# Altium schematic sheet CONNECTOR_B.SchDoc: =project_title
size Tabloid; CompanyName: Luxonis Holding; Organization: Luxonis Holding; Address1: 1925 Harmony Park Drive; Address2: Westminster, CO; Address3: 80234; Address4: United States; SheetNumber: 6; SheetTotal: 14
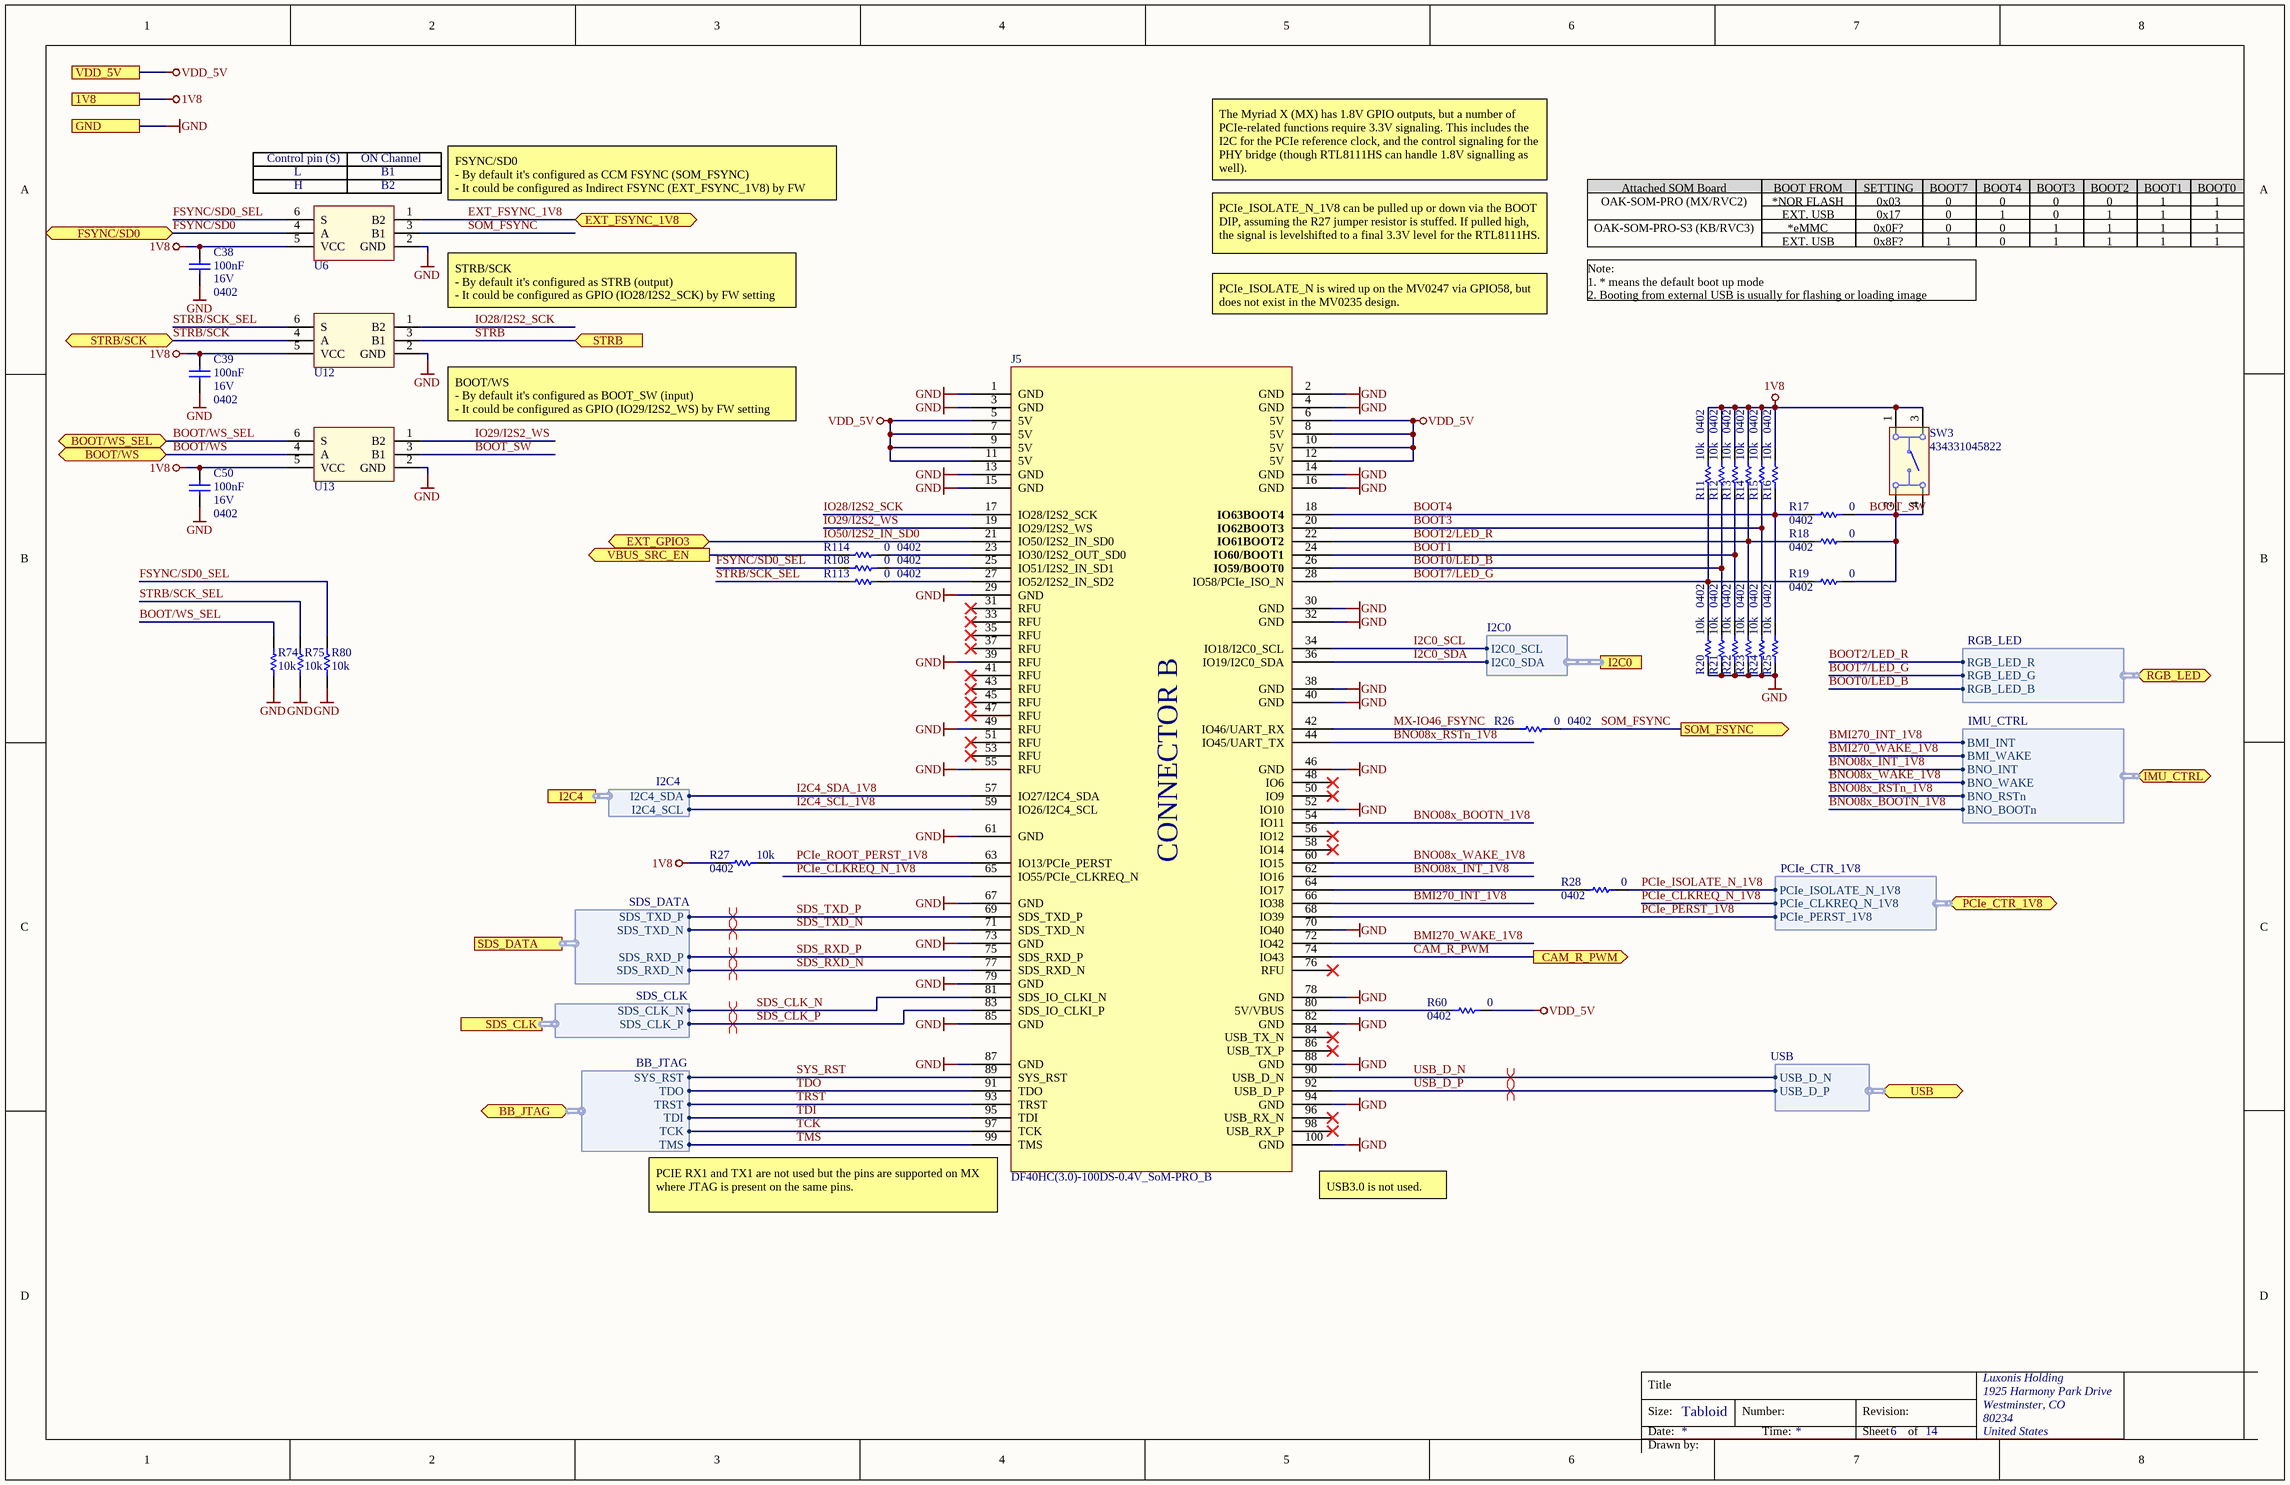
[diagram p0: CONNECTOR_B.SchDoc]

## Parts
C38  value 100nF  Voltage Rating: 16V  Case/Package: 0402  [CAPC0402(1005)60_N]  (hidden comment: CL05B104KO5NFNC)
C39  value 100nF  Voltage Rating: 16V  Case/Package: 0402  [CAPC0402(1005)60_N]  (hidden comment: CL05B104KO5NFNC)
C50  value 100nF  Voltage Rating: 16V  Case/Package: 0402  [CAPC0402(1005)60_N]  (hidden comment: CL05B104KO5NFNC)
J5  DF40HC(3.0)-100DS-0.4V_SoM-PRO_B  [CON_B_BW2099_SoM_DF40HC-3.0-100DS-0.4V_minpad]
R11  value 10k  Case/Package: 0402  [RESC0402(1005)_N]  (hidden comment: RC0402FR-1310KL)
R12  value 10k  Case/Package: 0402  [RESC0402(1005)_N]  (hidden comment: RC0402FR-1310KL)
R13  value 10k  Case/Package: 0402  [RESC0402(1005)_N]  (hidden comment: RC0402FR-1310KL)
R14  value 10k  Case/Package: 0402  [RESC0402(1005)_N]  (hidden comment: RC0402FR-1310KL)
R15  value 10k  Case/Package: 0402  [RESC0402(1005)_N]  (hidden comment: RC0402FR-1310KL)
R16  value 10k  Case/Package: 0402  [RESC0402(1005)_N]  (hidden comment: RC0402FR-1310KL)
R17  value 0  Case/Package: 0402  [RESC0402(1005)_L]  (hidden comment: CRCW04020000Z0ED)
R18  value 0  Case/Package: 0402  [RESC0402(1005)_L]  (hidden comment: CRCW04020000Z0ED)
R19  value 0  Case/Package: 0402  [RESC0402(1005)_L]  (hidden comment: CRCW04020000Z0ED)
R20  value 10k  Case/Package: 0402  [RESC0402(1005)_N]  (hidden comment: RC0402FR-1310KL)
R21  value 10k  Case/Package: 0402  [RESC0402(1005)_N]  (hidden comment: RC0402FR-1310KL)
R22  value 10k  Case/Package: 0402  [RESC0402(1005)_N]  (hidden comment: RC0402FR-1310KL)
R23  value 10k  Case/Package: 0402  [RESC0402(1005)_N]  (hidden comment: RC0402FR-1310KL)
R24  value 10k  Case/Package: 0402  [RESC0402(1005)_N]  (hidden comment: RC0402FR-1310KL)
R25  value 10k  Case/Package: 0402  [RESC0402(1005)_N]  (hidden comment: RC0402FR-1310KL)
R26  value 0  Case/Package: 0402  [RESC0402(1005)_L]  (hidden comment: CRCW04020000Z0ED)
R27  value 10k  Case/Package: 0402  [RESC0402(1005)_N]  (hidden comment: RC0402FR-1310KL)
R28  value 0  Case/Package: 0402  [RESC0402(1005)_L]  (hidden comment: CRCW04020000Z0ED)
R60  value 0  Case/Package: 0402  [RESC0402(1005)_L]  (hidden comment: CRCW04020000Z0ED)
R74  value 10k  [RESC0402(1005)_N]  (hidden comment: RC0402FR-1310KL)
R75  value 10k  [RESC0402(1005)_N]  (hidden comment: RC0402FR-1310KL)
R80  value 10k  [RESC0402(1005)_N]  (hidden comment: RC0402FR-1310KL)
R108  value 0  Case/Package: 0402  [RESC0402(1005)_L]  (hidden comment: CRCW04020000Z0ED)
R113  value 0  Case/Package: 0402  [RESC0402(1005)_L]  (hidden comment: CRCW04020000Z0ED)
R114  value 0  Case/Package: 0402  [RESC0402(1005)_L]  (hidden comment: CRCW04020000Z0ED)
SW3  434331045822  [434331045822]
U6  SN74LVC1G3157DCKR  [DCK6_65]  (value not drawn)
U12  SN74LVC1G3157DCKR  [DCK6_65]  (value not drawn)
U13  SN74LVC1G3157DCKR  [DCK6_65]  (value not drawn)

## Ports
1V8, BB_JTAG (bidir, harness BB_JTAG), BOOT/WS (bidir), BOOT/WS_SEL (bidir), CAM_R_PWM (out), EXT_FSYNC_1V8 (bidir), EXT_GPIO3 (bidir), FSYNC/SD0 (bidir), GND, I2C0 (harness I2C0), I2C4 (harness I2C4), IMU_CTRL (bidir, harness IMU_CTRL), PCIe_CTR_1V8 (bidir, harness PCIe_CTR_1V8), RGB_LED (bidir, harness RGB_LED), SDS_CLK (harness SDS_CLK), SDS_DATA (harness SDS_DATA), SOM_FSYNC (out), STRB (in), STRB/SCK (bidir), USB (bidir, harness USB), VBUS_SRC_EN (out), VDD_5V

## Harnesses
USB: USB_D_P, USB_D_N
I2C0: I2C0_SDA, I2C0_SCL
BB_JTAG: SYS_RST, TDO, TRST, TDI, TCK, TMS
SDS_DATA: SDS_TXD_P, SDS_TXD_N, SDS_RXD_P, SDS_RXD_N
PCIe_CTR_1V8: PCIe_CLKREQ_N_1V8, PCIe_ISOLATE_N_1V8, PCIe_PERST_1V8
SDS_CLK: SDS_CLK_P, SDS_CLK_N
RGB_LED: RGB_LED_G, RGB_LED_B, RGB_LED_R
IMU_CTRL: BMI_INT, BMI_WAKE, BNO_INT, BNO_WAKE, BNO_RSTn, BNO_BOOTn
I2C4: I2C4_SDA, I2C4_SCL

## Nets
1V8: C38.2 C39.2 C50.2 R11.2 R12.2 R13.2 R14.2 R15.2 R16.2 R27.2 SW3.1 SW3.3 U6.5(VCC) U12.5(VCC) U13.5(VCC) ; port 1V8
GND: C38.1 C39.1 C50.1 J5.1(GND) J5.2(GND) J5.3(GND) J5.4(GND) J5.13(GND) J5.14(GND) J5.15(GND) J5.16(GND) J5.29(GND) J5.30(GND) J5.32(GND) J5.38(GND) J5.39(RFU) J5.40(GND) J5.46(GND) J5.49(RFU) J5.52(IO10) J5.55(RFU) J5.61(GND) J5.67(GND) J5.70(IO40) J5.73(GND) J5.78(GND) J5.79(GND) J5.82(GND) J5.85(GND) J5.87(GND) J5.88(GND) J5.94(GND) J5.100(GND) R20.1 R21.1 R22.1 R23.1 R24.1 R25.1 R74.1 R75.1 R80.1 U6.2(GND) U12.2(GND) U13.2(GND) ; port GND
VDD_5V: J5.5(5V) J5.6(5V) J5.7(5V) J5.8(5V) J5.9(5V) J5.10(5V) J5.11(5V) J5.12(5V) R60.2 ; port VDD_5V
BMI270_INT_1V8: J5.66(IO38) ; port IMU_CTRL.BMI_INT
BMI270_WAKE_1V8: J5.72(IO42) ; port IMU_CTRL.BMI_WAKE
BNO08x_BOOTN_1V8: J5.54(IO11) ; port IMU_CTRL.BNO_BOOTn
BNO08x_INT_1V8: J5.62(IO16) ; port IMU_CTRL.BNO_INT
BNO08x_RSTn_1V8: J5.44(IO45/UART_TX) ; port IMU_CTRL.BNO_RSTn
BNO08x_WAKE_1V8: J5.60(IO15) ; port IMU_CTRL.BNO_WAKE
BOOT0/LED_B: J5.26(IO59/BOOT0) R12.1 R21.2 ; port RGB_LED.RGB_LED_B
BOOT1: J5.24(IO60/BOOT1) R13.1 R22.2
BOOT2/LED_R: J5.22(IO61BOOT2) R14.1 R18.1 R23.2 ; port RGB_LED.RGB_LED_R
BOOT3: J5.20(IO62BOOT3) R15.1 R24.2
BOOT4: J5.18(IO63BOOT4) R16.1 R17.1 R25.2
BOOT7/LED_G: J5.28(IO58/PCIe_ISO_N) R11.1 R19.1 R20.2 ; port RGB_LED.RGB_LED_G
BOOT/WS: U13.4(A) ; port BOOT/WS
BOOT/WS_SEL: R74.2 U13.6(S) ; port BOOT/WS_SEL
BOOT_SW: R17.2 R18.2 R19.2 SW3.2 SW3.4 U13.3(B1)
CAM_R_PWM: J5.74(IO43) ; port CAM_R_PWM
EXT_FSYNC_1V8: U6.1(B2) ; port EXT_FSYNC_1V8
FSYNC/SD0: U6.4(A) ; port FSYNC/SD0
FSYNC/SD0_SEL: R80.2 R108.1 U6.6(S)
I2C0_SCL: J5.34(IO18/I2C0_SCL) ; port I2C0.I2C0_SCL
I2C0_SDA: J5.36(IO19/I2C0_SDA) ; port I2C0.I2C0_SDA
I2C4_SCL_1V8: J5.59(IO26/I2C4_SCL) ; port I2C4.I2C4_SCL
I2C4_SDA_1V8: J5.57(IO27/I2C4_SDA) ; port I2C4.I2C4_SDA
IO28/I2S2_SCK: J5.17(IO28/I2S2_SCK) U12.1(B2)
IO29/I2S2_WS: J5.19(IO29/I2S2_WS) U13.1(B2)
IO50/I2S2_IN_SD0: J5.21(IO50/I2S2_IN_SD0) ; port EXT_GPIO3
MX-IO46_FSYNC: J5.42(IO46/UART_RX) R26.1
PCIe_CLKREQ_N_1V8: J5.65(IO55/PCIe_CLKREQ_N) ; port PCIe_CTR_1V8.PCIe_CLKREQ_N_1V8
PCIe_ISOLATE_N_1V8: R28.2 ; port PCIe_CTR_1V8.PCIe_ISOLATE_N_1V8
PCIe_PERST_1V8: J5.68(IO39) ; port PCIe_CTR_1V8.PCIe_PERST_1V8
PCIe_ROOT_PERST_1V8: J5.63(IO13/PCIe_PERST) R27.1
SDS_CLK_N: J5.81(SDS_IO_CLKI_N) ; port SDS_CLK.SDS_CLK_N
SDS_CLK_P: J5.83(SDS_IO_CLKI_P) ; port SDS_CLK.SDS_CLK_P
SDS_RXD_N: J5.77(SDS_RXD_N) ; port SDS_DATA.SDS_RXD_N
SDS_RXD_P: J5.75(SDS_RXD_P) ; port SDS_DATA.SDS_RXD_P
SDS_TXD_N: J5.71(SDS_TXD_N) ; port SDS_DATA.SDS_TXD_N
SDS_TXD_P: J5.69(SDS_TXD_P) ; port SDS_DATA.SDS_TXD_P
SOM_FSYNC: R26.2 U6.3(B1) ; port SOM_FSYNC
STRB: U12.3(B1) ; port STRB
STRB/SCK: U12.4(A) ; port STRB/SCK
STRB/SCK_SEL: R75.2 R113.1 U12.6(S)
SYS_RST: J5.89(SYS_RST) ; port BB_JTAG.SYS_RST
TCK: J5.97(TCK) ; port BB_JTAG.TCK
TDI: J5.95(TDI) ; port BB_JTAG.TDI
TDO: J5.91(TDO) ; port BB_JTAG.TDO
TMS: J5.99(TMS) ; port BB_JTAG.TMS
TRST: J5.93(TRST) ; port BB_JTAG.TRST
USB_D_N: J5.90(USB_D_N) ; port USB.USB_D_N
USB_D_P: J5.92(USB_D_P) ; port USB.USB_D_P
VBUS_SRC_EN: R114.1 ; port VBUS_SRC_EN
NetJ5_23: J5.23(IO30/I2S2_OUT_SD0) R114.2
NetJ5_25: J5.25(IO51/I2S2_IN_SD1) R108.2
NetJ5_27: J5.27(IO52/I2S2_IN_SD2) R113.2
NetJ5_64: J5.64(IO17) R28.1
NetJ5_80: J5.80(5V/VBUS) R60.1

Not connected (* = marked no-connect by the designer): J5 31(RFU)* 33(RFU)* 35(RFU)* 37(RFU)* 41(RFU)* 43(RFU)* 45(RFU)* 47(RFU)* 48(IO6)* 50(IO9)* 51(RFU)* 53(RFU)* 56(IO12)* 58(IO14)* 76(RFU)* 84(USB_TX_N)* 86(USB_TX_P)* 96(USB_RX_N)* 98(USB_RX_P)*

## Layout directives
differential pair; net class USB2; differential pair class 85ohm: USB_D_N, USB_D_P
differential pair; net class PCIE; differential pair class 100ohm: SDS_CLK_N, SDS_CLK_P, SDS_RXD_N, SDS_RXD_P, SDS_TXD_N, SDS_TXD_P

## Notes on the sheet
- Control pin (S)
- ON Channel
- (near U6) L
- (near U6) H
- (near U6) B1
- (near U6) B2
- FSYNC/SD0
  - By default it's configured as CCM FSYNC (SOM_FSYNC)
  - It could be configured as Indirect FSYNC (EXT_FSYNC_1V8) by FW setting
- The Myriad X (MX) has 1.8V GPIO outputs, but a number of PCIe-related functions require 3.3V signaling. This includes the I2C for the PCIe reference clock, and the control signaling for the PHY bridge (though RTL8111HS can handle 1.8V signalling as well).
- Attached SOM Board
- OAK-SOM-PRO (MX/RVC2)
- BOOT FROM
- *NOR FLASH
- EXT. USB
- *eMMC
- SETTING
- 0x03
- 0x17
- 0x0F?
- BOOT7
- 0
- BOOT4
- 1
- BOOT3
- BOOT2
- BOOT1
- BOOT0
- STRB/SCK
  - By default it's configured as STRB (output)
  - It could be configured as GPIO (IO28/I2S2_SCK) by FW setting
- PCIe_ISOLATE_N_1V8 can be pulled up or down via the BOOT DIP, assuming the R27 jumper resistor is stuffed. If pulled high, the signal is levelshifted to a final 3.3V level for the RTL8111HS.
- OAK-SOM-PRO-S3 (KB/RVC3)
- Note:
  1. * means the default boot up mode
  2. Booting from external USB is usually for flashing or loading image
- 0x8F?
- PCIe_ISOLATE_N is wired up on the MV0247 via GPIO58, but does not exist in the MV0235 design.
- BOOT/WS
  - By default it's configured as BOOT_SW (input)
  - It could be configured as GPIO (IO29/I2S2_WS) by FW setting
- (near J5) PCIE RX1 and TX1 are not used but the pins are supported on MX where JTAG is present on the same pins.
- (near J5) USB3.0 is not used.
- Title
- Size:
- Date:
- Tabloid
- Number:
- Time:
- Revision:
- Sheet
- of
- Drawn by:
- (in symbol CMP-005-000053-5) CONNECTOR B

## Library data of the parts
C38 C39 C50 = CMP-108-000002-6: CAP CER 0.1UF 16V X7R 0402 10%; Manufacturer 1: Samsung; ComponentLink1URL: https://datasheet.ciiva.com/25767/cl05b104ko5nfnc-25767124.pdf?src-supplier=Digi-Key; Length: 1mm; Design Item ID: CL05B104KO5NFNC; Tolerance: 10%; Min Operating Temperature: -55°C; Width: 0.02inch; Dielectric: X7R; ComponentLink1Description: https://datasheet.ciiva.com/25767/cl05b104ko5nfnc-25767124.pdf?src-supplier=Digi-Key; Height: 0.5mm; Depth: 0.5mm; Manufacturer Part Number 1: CL05B104KO5NFNC; Max Operating Temperature: 125°C; Mounting Technology: SMT
J5 = CMP-005-000053-5: OAK-SoM-Pro base board conn. B; Manufacturer Part Number 1: DF40HC(3.0)-100DS-0.4V(58); Manufacturer 1: Hirose; Connector Type: Receptacle; Pitch: 0.016inch; Number of Positions: 100; System: Connector; Design Item ID: DF40HC(3.0)-100DS-0.4V_SoM-PRO_B; Stock 1: 2172; Stock 2: 2078; Contact Plating: Gold; Lead Free: Lead Free; Pricing 2: 1=2.50000, 10=2.40000, 25=2.10000, 50=2.10000, 100=2.00000, 250=1.76000, 500=1.71000, 1000=1.45000, 2000=1.36000, 5000=1.31000, 10000=1.31000 (USD); ComponentLink4Description: https://datasheet.ciiva.com/18562/ed-df40-20140305-18562462.pdf?src-supplier=Digi-Key; Mount: Surface Mount; Number of Rows: 2; ComponentLink1URL: https://datasheet.ciiva.com/46636/ed-df40-20140305-46636517.pdf?src-supplier=Digi-Key; ComponentLink2URL: https://datasheet.ciiva.com/18562/ed-df40-20140305-18562189.pdf?src-supplier=Digi-Key; ComponentLink4URL: https://datasheet.ciiva.com/18562/ed-df40-20140305-18562462.pdf?src-supplier=Digi-Key; Source: LuxonisMaster.SchLib; Pricing 1: 1=2.54000, 10=2.26000, 25=2.07000, 50=2.07000, 100=1.98000, 250=1.79000, 500=1.65000, 1000=1.41000, 3000=1.32000, 6000=1.23000, 10000=1.23000 (USD); ComponentLink2Description: https://datasheet.ciiva.com/18562/ed-df40-20140305-18562189.pdf?src-supplier=Digi-Key; RoHS: Yes; ComponentLink3URL: https://datasheet.ciiva.com/13559/ed-df40-20140305-13559540.pdf?src-supplier=Mouser; Package Quantity: 1000; Packaging: Tape and Reel; ComponentLink1Description: https://datasheet.ciiva.com/46636/ed-df40-20140305-46636517.pdf?src-supplier=Digi-Key; ComponentLink3Description: https://datasheet.ciiva.com/13559/ed-df40-20140305-13559540.pdf?src-supplier=Mouser; Pins: 100
R11-R16 R20-R25 R27 R74 R75 R80 = CMP-115-000004-8: RES SMD 10K OHM 1% 1/16W 0402; Manufacturer 1: Yageo; Power Rating: 62.5mW; Temperature Coefficient: 100ppm/°C; Voltage Rating: 50V; Min Operating Temperature: -55°C; Max Operating Temperature: 155°C; Design Item ID: RC0402FR-1310KL; Tolerance: 1%; Manufacturer Part Number 1: RC0402FR-1310KL
  R74 R75 R80: Case/Package: 0402
R17-R19 R26 R28 R60 R108 R113 R114 = CMP-013-000022-11: RES SMD 0 OHM 5% 1/16W 0402; Manufacturer 1: Vishay; Voltage Rating: 50V; Power Rating: 63mW; Max Operating Temperature: 155°C; Manufacturer Part Number 1: CRCW04020000Z0ED; Tolerance: 5%; Min Operating Temperature: -55°C; Design Item ID: CRCW04020000Z0ED
SW3 = CMP-011-00016-3: Keypad Switch, 1 Switches, SPST, Momentary-tactile, 0.05A, 12VDC, 2.65N, Solder Terminal, Surface Mount-right Angle; Manufacturer 1: Wurth Electronics; Voltage Rating: 12V; Max Current Rating: 50mA; Throw Configuration: SPST-NO; Supplier Part Number 1: 732-7055-2-ND; Manufacturer part number 1: 434331045822; Pins: 4; Supplier 1: Digi-Key; Current Rating: 50mA; Mounting Technology: SMD; Case/Package: 434331045822
U6 U12 U13 = CMP-010-000023-2: IC SWITCH SPDT SC70-6 1 Circuit IC Switch 2:1 15Ohm SC-70-6; Manufacturer 1: Texas Instruments; Max Operating Temperature: 125°C; Manufacturer Part Number 1: SN74LVC1G3157DCKR; Min Operating Temperature: -40°C; Case/Package: SC